# EAGLE design M516A (EAGLE 6.6.0)
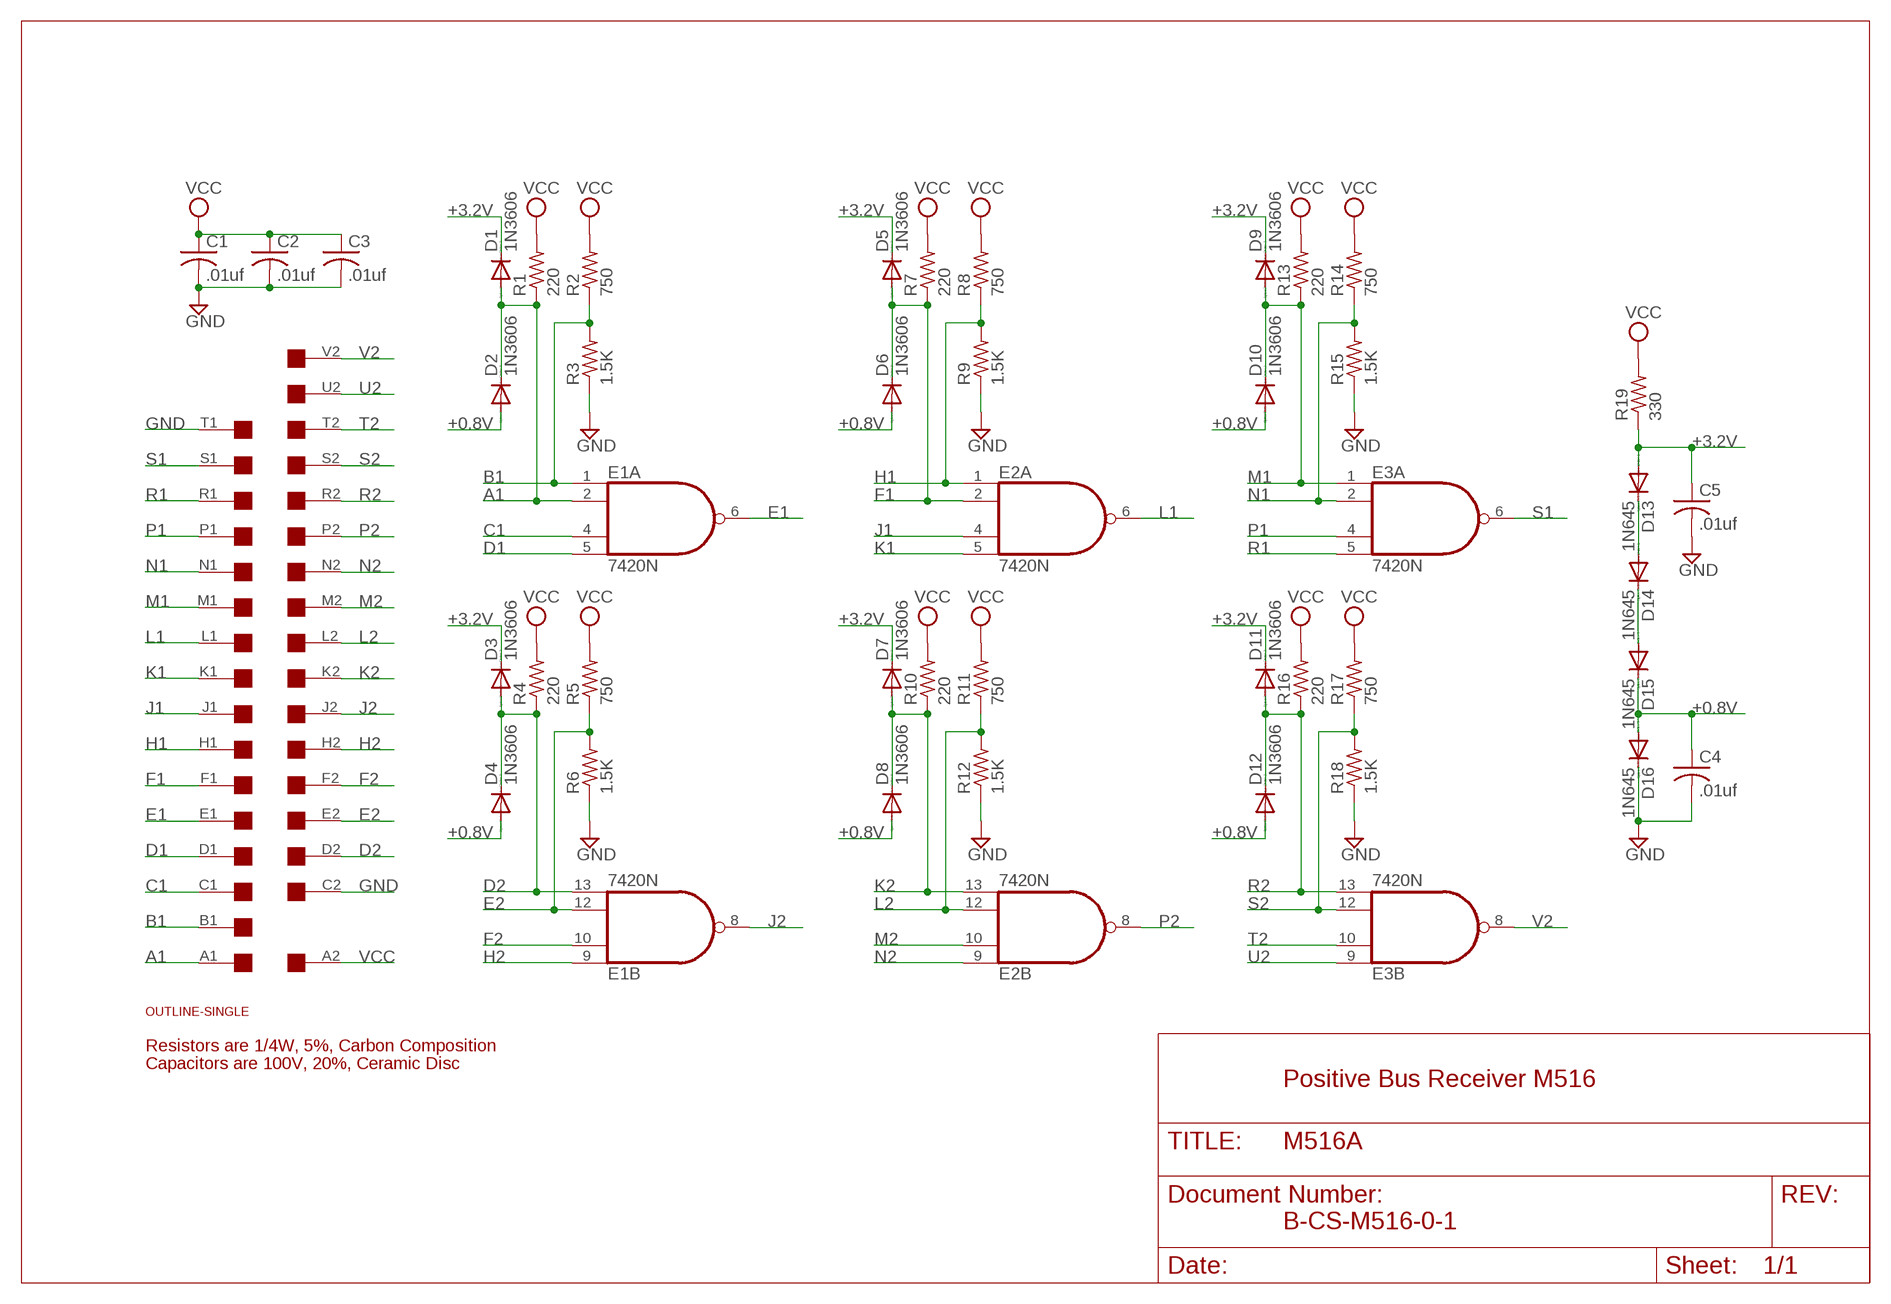
[diagram p0: schematic, sheet 1]

## Parts
C1  .01uf  C-US050-025X075  [C050-025X075]
C2  .01uf  C-US050-025X075  [C050-025X075]
C3  .01uf  C-US050-025X075  [C050-025X075]
C4  .01uf  C-US050-025X075  [C050-025X075]
C5  .01uf  C-US050-025X075  [C050-025X075]
D1  1N3606  1N4148DO35-10  [DO35-10]
D2  1N3606  1N4148DO35-10  [DO35-10]
D3  1N3606  1N4148DO35-10  [DO35-10]
D4  1N3606  1N4148DO35-10  [DO35-10]
D5  1N3606  1N4148DO35-10  [DO35-10]
D6  1N3606  1N4148DO35-10  [DO35-10]
D7  1N3606  1N4148DO35-10  [DO35-10]
D8  1N3606  1N4148DO35-10  [DO35-10]
D9  1N3606  1N4148DO35-10  [DO35-10]
D10  1N3606  1N4148DO35-10  [DO35-10]
D11  1N3606  1N4148DO35-10  [DO35-10]
D12  1N3606  1N4148DO35-10  [DO35-10]
D13  1N645  1N4148DO35-10  [DO35-10]
D14  1N645  1N4148DO35-10  [DO35-10]
D15  1N645  1N4148DO35-10  [DO35-10]
D16  1N645  1N4148DO35-10  [DO35-10]
E1  7420N  74S20N  [DIL14]
E2  7420N  74S20N  [DIL14]
E3  7420N  74S20N  [DIL14]
R1  220  R-US_0207/10  [0207/10]
R2  750  R-US_0207/10  [0207/10]
R3  1.5K  R-US_0207/10  [0207/10]
R4  220  R-US_0207/10  [0207/10]
R5  750  R-US_0207/10  [0207/10]
R6  1.5K  R-US_0207/10  [0207/10]
R7  220  R-US_0207/10  [0207/10]
R8  750  R-US_0207/10  [0207/10]
R9  1.5K  R-US_0207/10  [0207/10]
R10  220  R-US_0207/10  [0207/10]
R11  750  R-US_0207/10  [0207/10]
R12  1.5K  R-US_0207/10  [0207/10]
R13  220  R-US_0207/10  [0207/10]
R14  750  R-US_0207/10  [0207/10]
R15  1.5K  R-US_0207/10  [0207/10]
R16  220  R-US_0207/10  [0207/10]
R17  750  R-US_0207/10  [0207/10]
R18  1.5K  R-US_0207/10  [0207/10]
R19  330  R-US_0207/10  [0207/10]
U$1  OUTLINE-SINGLE  [SINGLE]
U$2  SINGLE  [EDGE-CON2]

## Nets
+0.8V: C4.1 D2.A D4.A D6.A D8.A D10.A D12.A D15.C D16.A
+3.2V: C5.1 D1.C D3.C D5.C D7.C D9.C D11.C D13.A R19.1
A1: D1.A D2.C E1.2(A:I1) R1.1 U$2.A1
B1: E1.1(A:I0) R2.1 R3.2 U$2.B1
C1: E1.4(A:I2) U$2.C1
D1: E1.5(A:I3) U$2.D1
D2: D3.A D4.C E1.13(B:I3) R4.1 U$2.D2
E1: E1.6(A:O) U$2.E1
E2: E1.12(B:I2) R5.1 R6.2 U$2.E2
F1: D5.A D6.C E2.2(A:I1) R7.1 U$2.F1
F2: E1.10(B:I1) U$2.F2
GND [Supply]: C1.2 C2.2 C3.2 C4.2 C5.2 D16.C R3.1 R6.1 R9.1 R12.1 R15.1 R18.1 U$2.C2 U$2.T1
H1: E2.1(A:I0) R8.1 R9.2 U$2.H1
H2: E1.9(B:I0) U$2.H2
J1: E2.4(A:I2) U$2.J1
J2: E1.8(B:O) U$2.J2
K1: E2.5(A:I3) U$2.K1
K2: D7.A D8.C E2.13(B:I3) R10.1 U$2.K2
L1: E2.6(A:O) U$2.L1
L2: E2.12(B:I2) R11.1 R12.2 U$2.L2
M1: D9.A D10.C E3.1(A:I0) R13.1 U$2.M1
M2: E2.10(B:I1) U$2.M2
N1: E3.2(A:I1) R14.1 R15.2 U$2.N1
N2: E2.9(B:I0) U$2.N2
N$49: D13.C D14.A
N$50: D14.C D15.A
P1: E3.4(A:I2) U$2.P1
P2: E2.8(B:O) U$2.P2
R1: E3.5(A:I3) U$2.R1
R2: D11.A D12.C E3.13(B:I3) R16.1 U$2.R2
S1: E3.6(A:O) U$2.S1
S2: E3.12(B:I2) R17.1 R18.2 U$2.S2
T2: E3.10(B:I1) U$2.T2
U2: E3.9(B:I0) U$2.U2
V2: E3.8(B:O) U$2.V2
VCC [Supply]: C1.1 C2.1 C3.1 R1.2 R2.2 R4.2 R5.2 R7.2 R8.2 R10.2 R11.2 R13.2 R14.2 R16.2 R17.2 R19.2 U$2.A2
Unconnected: U$2.B2 U$2.U1 U$2.V1

## Notes on the sheet
- Resistors are 1/4W, 5%, Carbon Composition
- Capacitors are 100V, 20%, Ceramic Disc
- Positive Bus Receiver M516
- B-CS-M516-0-1

## Power pins joined to a net without a drawn wire
GND: E1.7(P:GND) E2.7(P:GND) E3.7(P:GND)
VCC: E1.14(P:VCC) E2.14(P:VCC) E3.14(P:VCC)

## Library data of the parts
C1-C5 = rcl:C-US: CAPACITOR, American symbol
D1-D16 = diode:1N4148: DIODE high speed (Philips)
E1-E3 = 74xx-us:74*20: Dual 4-input NAND gate
R1-R19 = rcl:R-US_: RESISTOR, American symbol
U$1 = dec-con:OUTLINE-*: Board outlines for DEC boards.
U$2 = dec-con:SINGLE: Single-Height DEC board

## Net classes
1 Supply: width 0.813 mm

## Board
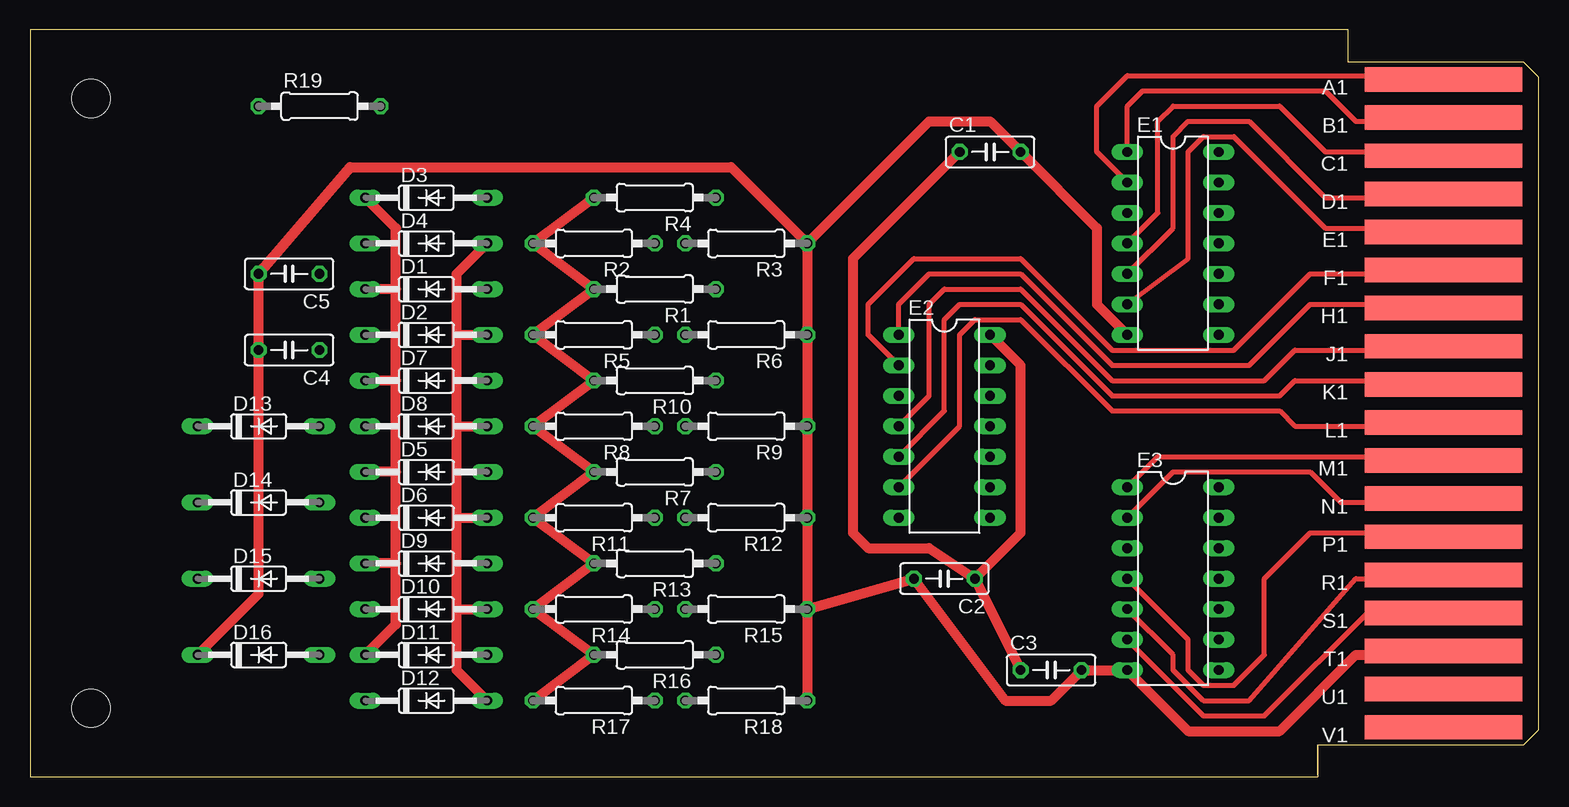
[diagram p1: board, top side]
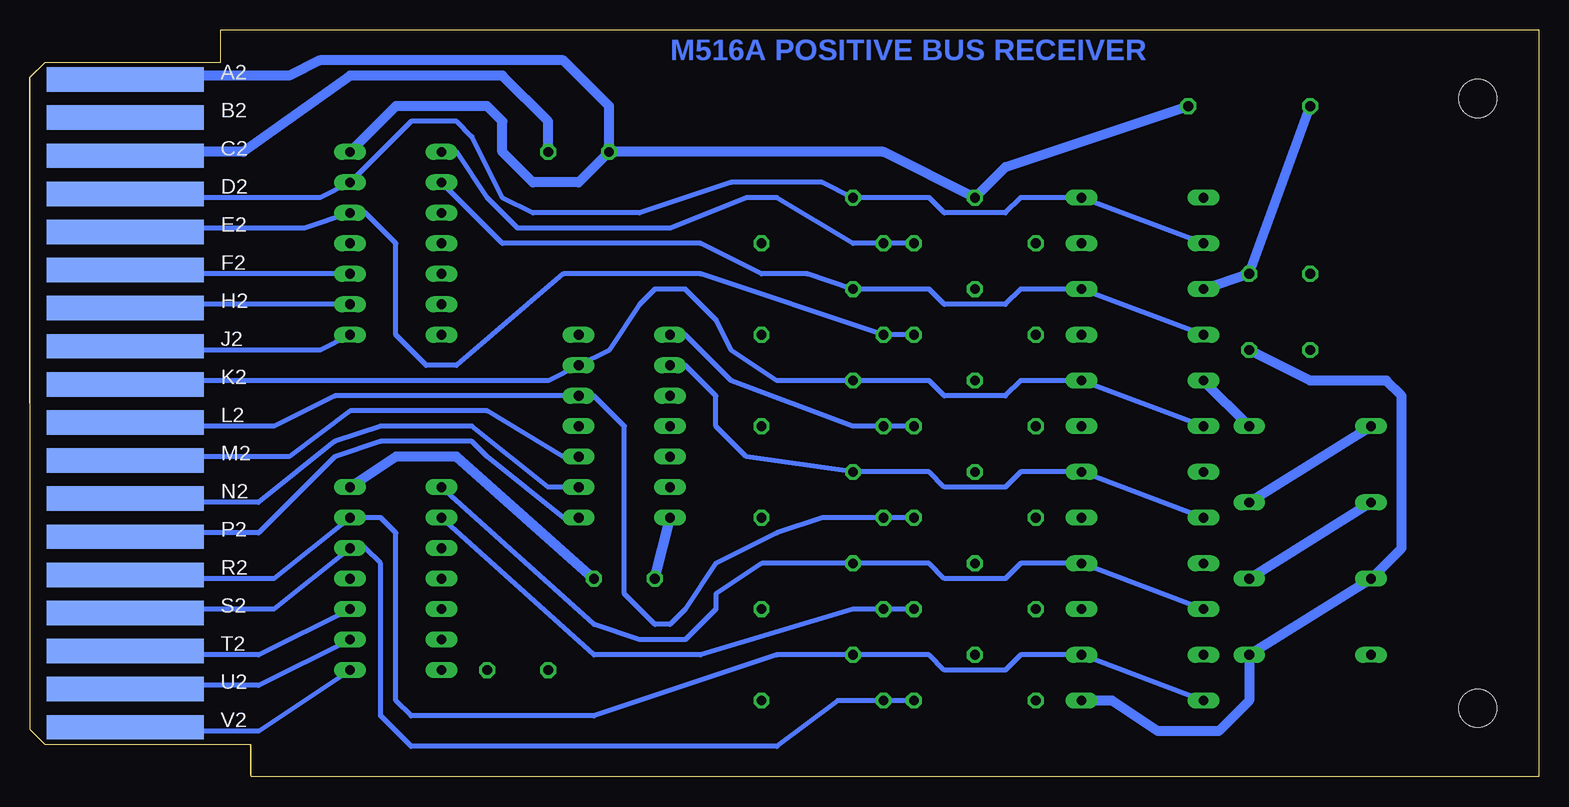
[diagram p2: board, bottom side, seen from below]

Size 125.73 x 62.23 mm. Coordinates in mm from the lower left corner, seen from the top.
Copper layers (1+16): Top 0.035mm / dielectric 1.5mm / Bottom 0.035mm
Design rules "16mils": minimum track width 16mil, minimum drill 32mil, track to track 15mil, track to pad 10mil, pad to pad 10mil, via to via 10mil, smd to smd 10mil, copper to edge 13mil, drill to drill 10mil, minimum pad ring 10mil, minimum via ring 8mil, stop-mask expansion 0mil, vias tented up to drill 0mil, thermal gap 10mil

### Footprints (pad centres in the part's own frame; a part is rotated, then mirrored left to right if it is on the bottom)
C050-025X075 = drill 0.813 octagon: 1 -2.54,0; 2 2.54,0
DO35-10 = drill 0.813 long: A 5.08,0; C -5.08,0
DIL14 = drill 0.813 long: 1 -7.62,-3.81; 2 -5.08,-3.81; 3 -2.54,-3.81; 4 0,-3.81; 5 2.54,-3.81; 6 5.08,-3.81; 7 7.62,-3.81; 8 7.62,3.81; 9 5.08,3.81; 10 2.54,3.81; 11 0,3.81; 12 -2.54,3.81; 13 -5.08,3.81; 14 -7.62,3.81
0207/10 = drill 0.813 octagon: 1 -5.08,0; 2 5.08,0
SINGLE = hole 3.175: 120.65,56.515; 120.65,5.715
EDGE-CON2 = smd 13.106 x 2.032: A1 7.938,4.128; B1 7.938,7.303; C1 7.938,10.477; D1 7.938,13.652; E1 7.938,16.828; F1 7.938,20.003; H1 7.938,23.177; J1 7.938,26.352; K1 7.938,29.527; L1 7.938,32.703; M1 7.938,35.877; N1 7.938,39.053; P1 7.938,42.227; R1 7.938,45.403; S1 7.938,48.578; T1 7.938,51.752; U1 7.938,54.928; V1 7.938,58.102 | smd 13.106 x 2.032 bottom: A2 7.938,4.128; B2 7.938,7.303; C2 7.938,10.477; D2 7.938,13.652; E2 7.938,16.828; F2 7.938,20.003; H2 7.938,23.177; J2 7.938,26.352; K2 7.938,29.527; L2 7.938,32.703; M2 7.938,35.877; N2 7.938,39.053; P2 7.938,42.227; R2 7.938,45.403; S2 7.938,48.578; T2 7.938,51.752; U2 7.938,54.928; V2 7.938,58.102

### Placement (x,y rotation side)
C1  80.01,52.07 0 top
C2  76.2,16.51 180 top
C3  85.09,8.89 0 top
C4  21.59,35.56 180 top
C5  21.59,41.91 180 top
D1  33.02,40.64 0 top
D2  33.02,36.83 0 top
D3  33.02,48.26 0 top
D4  33.02,44.45 0 top
D5  33.02,25.4 0 top
D6  33.02,21.59 0 top
D7  33.02,33.02 0 top
D8  33.02,29.21 0 top
D9  33.02,17.78 0 top
D10  33.02,13.97 0 top
D11  33.02,10.16 0 top
D12  33.02,6.35 0 top
D13  19.05,29.21 0 top
D14  19.05,22.86 0 top
D15  19.05,16.51 0 top
D16  19.05,10.16 0 top
E1  95.25,44.45 270 top
E2  76.2,29.21 270 top
E3  95.25,16.51 270 top
R1  52.07,40.64 180 top
R2  46.99,44.45 180 top
R3  59.69,44.45 180 top
R4  52.07,48.26 180 top
R5  46.99,36.83 180 top
R6  59.69,36.83 180 top
R7  52.07,25.4 180 top
R8  46.99,29.21 180 top
R9  59.69,29.21 180 top
R10  52.07,33.02 180 top
R11  46.99,21.59 180 top
R12  59.69,21.59 180 top
R13  52.07,17.78 180 top
R14  46.99,13.97 180 top
R15  59.69,13.97 180 top
R16  52.07,10.16 180 top
R17  46.99,6.35 180 top
R18  59.69,6.35 180 top
R19  24.13,55.88 0 top
U$1  125.73,62.23 180 top
U$2  125.73,62.23 180 top

### Tracks (layer width: path | path; a pad name or v marks a point on that pad's centre or on a via)
+0.8V
  Top 0.813: D12.A 35.56,8.89 35.56,13.97 | 35.56,13.97 35.56,21.59 | 35.56,21.59 35.56,29.21 | 35.56,29.21 35.56,36.83 | 35.56,36.83 35.56,41.91 D4.A | 35.56,13.97 D10.A | 35.56,36.83 D2.A | 35.56,21.59 D6.A | 35.56,29.21 D8.A
  Bottom 0.813: D12.A 35.56,6.35 31.75,3.81 26.67,3.81 24.13,6.35 D16.A D15.C 11.43,19.05 11.43,31.75 12.7,33.02 19.05,33.02 C4.1
+3.2V
  Top 0.813: 30.48,17.78 30.48,12.7 D11.C | 30.48,17.78 30.48,25.4 | 30.48,25.4 30.48,33.02 | 30.48,33.02 30.48,40.64 | 30.48,40.64 30.48,45.72 D3.C | 30.48,17.78 D9.C | 30.48,40.64 D1.C | 30.48,33.02 D7.C | 30.48,25.4 D5.C
  Bottom 0.813: R19.1 C5.1 D1.C | D7.C D13.A
A1
  Top 0.406: U$2.A1 116.84,58.42 91.44,58.42 88.9,55.88 88.9,52.07 E1.2
  Bottom 0.406: D2.C D1.A 43.18,40.64 44.45,39.37 49.53,39.37 50.8,40.64 R1.1 60.96,41.91 64.77,41.91 69.85,44.45 86.36,44.45 E1.2
B1
  Top 0.406: U$2.B1 116.84,54.61 110.49,54.61 107.95,57.15 92.71,57.15 91.44,55.88 E1.1
  Bottom 0.406: R2.1 R3.2 57.15,44.45 63.5,48.26 66.04,48.26 72.39,45.72 85.09,45.72 87.63,48.26 90.17,52.07 E1.1
C1
  Top 0.406: U$2.C1 116.84,52.07 107.95,52.07 104.14,55.88 95.25,55.88 93.98,54.61 93.98,46.99 E1.4
D1
  Top 0.406: U$2.D1 116.84,48.26 107.95,48.26 101.6,54.61 96.52,54.61 95.25,53.34 95.25,45.72 E1.5
D2
  Bottom 0.406: D4.C D3.A 43.18,48.26 44.45,46.99 49.53,46.99 50.8,48.26 R4.1 59.69,49.53 67.31,49.53 74.93,46.99 83.82,46.99 86.36,48.26 88.9,53.34 90.17,54.61 93.98,54.61 E1.13 101.6,48.26 116.84,48.26 U$2.D2
E1
  Top 0.406: U$2.E1 116.84,45.72 107.95,45.72 100.33,53.34 97.79,53.34 96.52,52.07 96.52,43.18 E1.6
E2
  Bottom 0.406: R5.1 R6.2 69.85,41.91 81.28,41.91 90.17,34.29 92.71,34.29 95.25,36.83 95.25,44.45 97.79,46.99 E1.12 102.87,45.72 116.84,45.72 U$2.E2
F1
  Top 0.406: U$2.F1 116.84,41.91 106.68,41.91 100.33,35.56 90.17,35.56 82.55,43.18 73.66,43.18 69.85,39.37 69.85,36.83 E2.2
  Bottom 0.406: D6.C D5.A 43.18,25.4 44.45,24.13 49.53,24.13 50.8,25.4 R7.1 66.04,26.67 68.58,29.21 68.58,31.75 71.12,34.29 E2.2
F2
  Bottom 0.406: U$2.F2 116.84,41.91 E1.10
GND
  Top 0.813: R15.1 R18.1 | R15.1 R12.1 R9.1 R6.1 R3.1 | D16.C 19.05,15.24 C4.2 C5.2 26.67,50.8 58.42,50.8 R3.1 | R3.1 74.93,54.61 80.01,54.61 C1.2 88.9,45.72 88.9,39.37 E1.7 | U$2.T1 116.84,10.16 110.49,10.16 104.14,3.81 96.52,3.81 E3.7 C3.2 85.09,6.35 81.28,6.35 C2.2 R15.1
  Bottom 0.813: U$2.C2 116.84,52.07 107.95,52.07 99.06,58.42 86.36,58.42 82.55,54.61 C1.2 | C2.2 E2.7
H1
  Top 0.406: U$2.H1 116.84,39.37 106.68,39.37 101.6,34.29 90.17,34.29 82.55,41.91 74.93,41.91 72.39,39.37 E2.1
  Bottom 0.406: R8.1 R9.2 57.15,29.21 67.31,33.02 71.12,36.83 E2.1
H2
  Bottom 0.406: U$2.H2 116.84,39.37 E1.9
J1
  Top 0.406: U$2.J1 116.84,35.56 105.41,35.56 102.87,33.02 90.17,33.02 82.55,40.64 76.2,40.64 74.93,39.37 74.93,31.75 E2.4
J2
  Bottom 0.406: U$2.J2 116.84,35.56 101.6,35.56 E1.8
K1
  Top 0.406: U$2.K1 116.84,33.02 105.41,33.02 104.14,31.75 90.17,31.75 82.55,39.37 77.47,39.37 76.2,38.1 76.2,30.48 E2.5
K2
  Bottom 0.406: D8.C D7.A 43.18,33.02 44.45,31.75 49.53,31.75 50.8,33.02 R10.1 63.5,33.02 67.31,35.56 68.58,38.1 71.12,40.64 73.66,40.64 74.93,39.37 77.47,35.56 E2.13 82.55,33.02 116.84,33.02 U$2.K2
L1
  Top 0.406: U$2.L1 116.84,29.21 105.41,29.21 104.14,30.48 90.17,30.48 82.55,38.1 78.74,38.1 77.47,36.83 77.47,29.21 E2.6
L2
  Bottom 0.406: R11.1 R12.2 59.69,21.59 63.5,20.32 68.58,17.78 71.12,13.97 72.39,12.7 73.66,12.7 76.2,15.24 76.2,29.21 78.74,31.75 E2.12 100.33,31.75 105.41,29.21 116.84,29.21 U$2.L2
M1
  Top 0.406: U$2.M1 116.84,26.67 93.98,26.67 E3.1
  Bottom 0.406: D10.C D9.A 43.18,17.78 44.45,16.51 49.53,16.51 50.8,17.78 R13.1 64.77,17.78 68.58,15.24 68.58,13.97 71.12,11.43 74.93,11.43 78.74,12.7 E3.1
M2
  Bottom 0.406: U$2.M2 116.84,26.67 104.14,26.67 99.06,30.48 87.63,30.48 81.28,26.67 E2.10
N1
  Top 0.406: U$2.N1 116.84,22.86 109.22,22.86 106.68,25.4 95.25,25.4 E3.2
  Bottom 0.406: R14.1 R15.2 57.15,13.97 69.85,10.16 78.74,10.16 E3.2
N2
  Bottom 0.406: U$2.N2 116.84,22.86 106.68,22.86 100.33,27.94 96.52,29.21 88.9,29.21 82.55,24.13 E2.9
N$49
  Bottom 0.813: D13.C D14.A
N$50
  Bottom 0.813: D14.C D15.A
P1
  Top 0.406: U$2.P1 116.84,20.32 106.68,20.32 102.87,16.51 102.87,10.16 100.33,7.62 97.79,7.62 96.52,8.89 96.52,11.43 E3.4
P2
  Bottom 0.406: E2.8 81.28,21.59 87.63,26.67 88.9,27.94 96.52,27.94 100.33,26.67 106.68,20.32 116.84,20.32 U$2.P2
R1
  Top 0.406: E3.5 95.25,10.16 95.25,8.89 97.79,6.35 101.6,6.35 110.49,16.51 116.84,16.51 U$2.R1
R2
  Bottom 0.406: U$2.R2 116.84,16.51 105.41,16.51 E3.13 96.52,21.59 95.25,20.32 95.25,6.35 93.98,5.08 78.74,5.08 63.5,10.16 R16.1 50.8,10.16 49.53,8.89 44.45,8.89 43.18,10.16 D11.A D12.C
S1
  Top 0.406: E3.6 97.79,5.08 102.87,5.08 111.76,13.97 116.84,13.97 U$2.S1
S2
  Bottom 0.406: U$2.S2 116.84,13.97 105.41,13.97 E3.12 97.79,19.05 96.52,17.78 96.52,5.08 93.98,2.54 63.5,2.54 58.42,6.35 R18.2 R17.1
T2
  Bottom 0.406: U$2.T2 116.84,10.16 106.68,10.16 E3.10
U2
  Bottom 0.406: U$2.U2 116.84,7.62 106.68,7.62 E3.9
V2
  Bottom 0.406: U$2.V2 117.23,4.2 116.84,3.81 106.68,3.81 E3.8
VCC
  Top 0.813: R17.2 R16.2 R14.2 R13.2 R11.2 R7.2 R8.2 R10.2 R5.2 R1.2 R2.2 R4.2 | C1.1 68.58,43.18 68.58,20.32 69.85,19.05 74.93,19.05 C2.1 | C2.1 C3.1 | C2.1 82.55,20.32 82.55,34.29 E2.14
  Bottom 0.813: R19.2 44.45,50.8 R4.2 54.61,52.07 C1.1 | C1.1 77.47,55.88 81.28,59.69 101.6,59.69 104.14,58.42 116.84,58.42 U$2.A2 | E1.14 95.25,55.88 87.63,55.88 86.36,54.61 86.36,52.07 83.82,49.53 80.01,49.53 C1.1 | E3.14 95.25,26.67 90.17,26.67 C2.1

### Text on the board
Bottom: M516A POSITIVE BUS RECEIVER